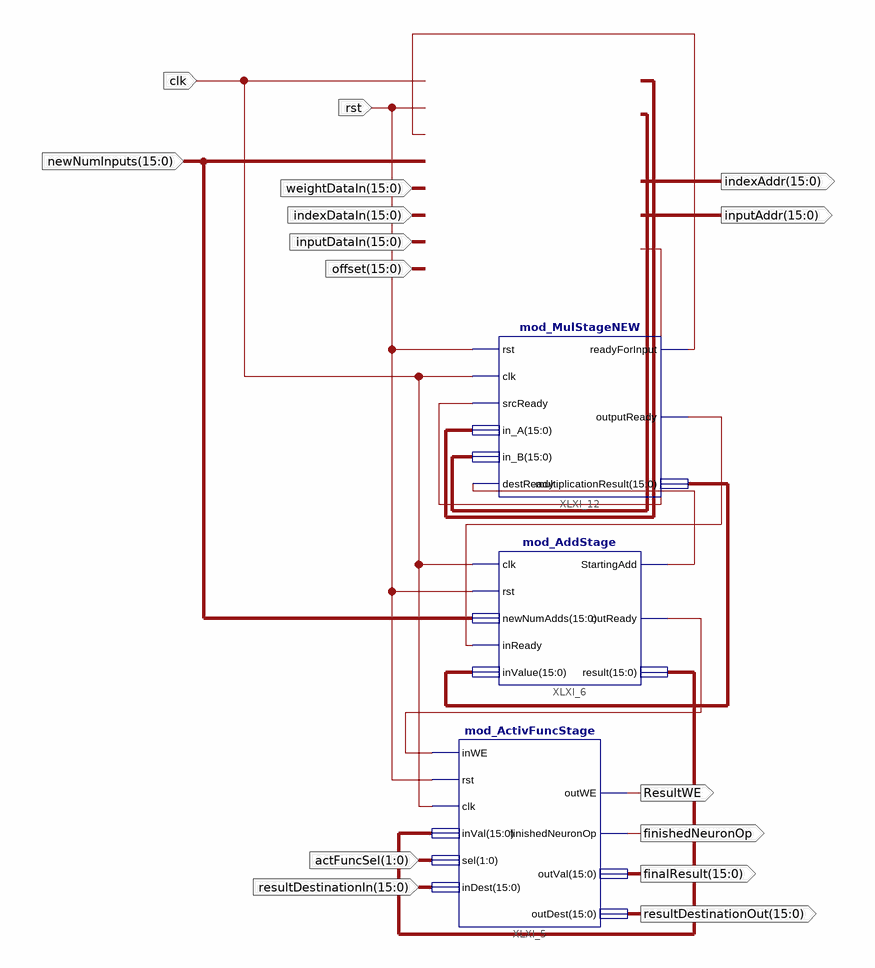
[diagram p0: schematic sheet 1]
// Xilinx ISE schematic mod_OpUnit.sch (spartan3e) as structural Verilog: 3 symbols, 15 ports
module mod_OpUnit (
  input  rst,
  input  [1:0] actFuncSel,
  input  [15:0] resultDestinationIn,
  input  [15:0] newNumInputs,
  input  [15:0] weightDataIn,
  input  [15:0] indexDataIn,
  input  [15:0] inputDataIn,
  input  [15:0] offset,
  input  clk,
  output [15:0] resultDestinationOut,
  output [15:0] finalResult,
  output ResultWE,
  output finishedNeuronOp,
  output [15:0] indexAddr,
  output [15:0] inputAddr
);

  wire XLXN_8, XLXN_9, XLXN_15, XLXN_16, XLXN_28;
  wire [15:0] XLXN_10, XLXN_11, XLXN_17, XLXN_27;

  mod_ActivFuncStage XLXI_5 (
    .inWE(XLXN_16), .rst(rst), .clk(clk), .inVal(XLXN_17), .sel(actFuncSel), .inDest(resultDestinationIn),
    .outWE(ResultWE), .finishedNeuronOp(finishedNeuronOp), .outVal(finalResult),
    .outDest(resultDestinationOut));
  mod_AddStage XLXI_6 (
    .clk(clk), .rst(rst), .newNumAdds(newNumInputs), .inReady(XLXN_28), .inValue(XLXN_27),
    .StartingAdd(XLXN_15), .outReady(XLXN_16), .result(XLXN_17));
  mod_MulStageNEW XLXI_12 (
    .rst(rst), .clk(clk), .srcReady(XLXN_9), .in_A(XLXN_10), .in_B(XLXN_11), .destReady(XLXN_15),
    .readyForInput(XLXN_8), .outputReady(XLXN_28), .multiplicationResult(XLXN_27));
endmodule
